# EAGLE schematic v0.7 (EAGLE 9.3.2)
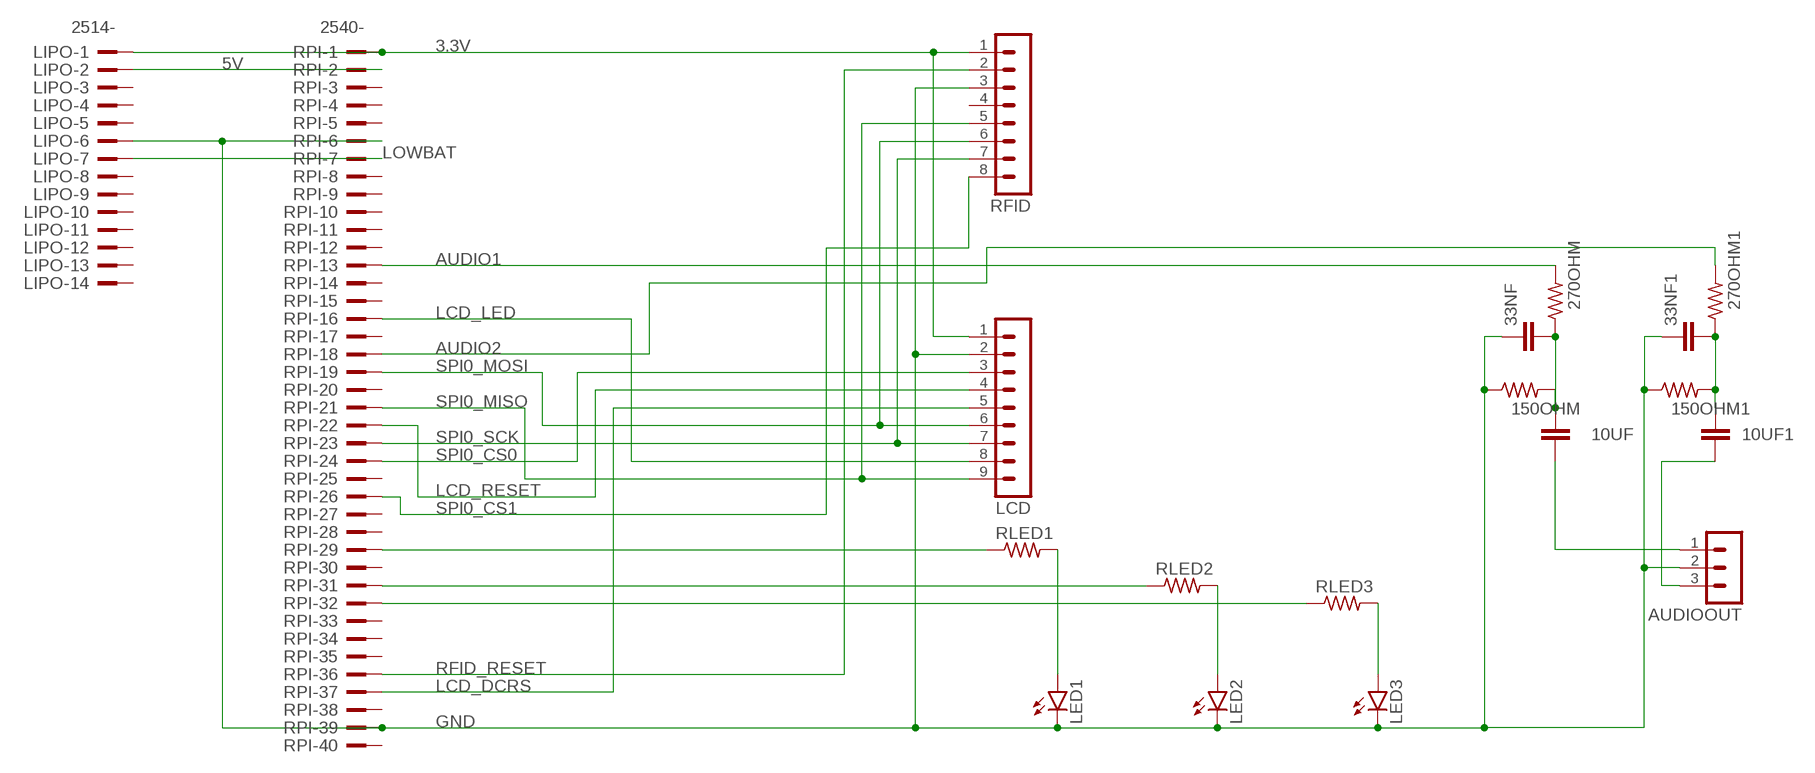
[diagram p0: schematic, sheet 1]

## Parts
10UF  C-EU025-025X050  [C025-025X050]
10UF1  C-EU025-025X050  [C025-025X050]
33NF  C-EU025-025X050  [C025-025X050]
33NF1  C-EU025-025X050  [C025-025X050]
150OHM  R-US_0204/5  [0204/5]
150OHM1  R-US_0204/5  [0204/5]
270OHM  R-US_0204/5  [0204/5]
270OHM1  R-US_0204/5  [0204/5]
AUDIOOUT  MA03-1  [MA03-1]
LCD  MA09-1  [MA09-1]
LED1  LED3MM  [LED3MM]
LED2  LED3MM  [LED3MM]
LED3  LED3MM  [LED3MM]
LIPO  2514-  [PAK100/2500-14]
RFID  MA08-1  [MA08-1]
RLED1  R-US_0204/5  [0204/5]
RLED2  R-US_0204/5  [0204/5]
RLED3  R-US_0204/5  [0204/5]
RPI  2540-  [PAK100/2500-40]

## Nets
3.3V [vcc]: LCD.1 LIPO.1 RFID.1 RPI.1
5V [vcc]: LIPO.2 RPI.2
AUDIO1 [audio]: 270OHM.2 RPI.13
AUDIO2 [audio]: 270OHM1.2 RPI.18
GND [ground]: 33NF1.1 33NF.1 150OHM1.1 150OHM.1 AUDIOOUT.2 LCD.2 LED1.K(C) LED2.K(C) LED3.K(C) LIPO.6 RFID.3 RPI.6 RPI.39
LCD_DCRS: LCD.5 RPI.37
LCD_LED: LCD.8 RPI.16
LCD_RESET: LCD.4 RPI.22
LOWBAT: LIPO.7 RPI.7
N$1: 10UF.2 33NF.2 150OHM.2 270OHM.1
N$2: LED2.A RLED2.2
N$3: LED3.A RLED3.2
N$4: RLED1.1 RPI.29
N$5: RLED2.1 RPI.31
N$6: RLED3.1 RPI.32
N$7: 10UF1.2 33NF1.2 150OHM1.2 270OHM1.1
N$8 [audio]: 10UF.1 AUDIOOUT.1
N$9 [audio]: 10UF1.1 AUDIOOUT.3
N$11: LED1.A RLED1.2
RFID_RESET: RFID.2 RPI.36
SPI0_CS0: LCD.3 RPI.24
SPI0_CS1: RFID.8 RPI.26
SPI0_MISO: LCD.9 RFID.5 RPI.21
SPI0_MOSI: LCD.6 RFID.6 RPI.19
SPI0_SCK: LCD.7 RFID.7 RPI.23
Unconnected: LIPO.3 LIPO.4 LIPO.5 LIPO.8 LIPO.9 LIPO.10 LIPO.11 LIPO.12 LIPO.13 LIPO.14 RFID.4 RPI.3 RPI.4 RPI.5 RPI.8 RPI.9 RPI.10 RPI.11 RPI.12 RPI.14 RPI.15 RPI.17 RPI.20 RPI.25 RPI.27 RPI.28 RPI.30 RPI.33 RPI.34 RPI.35 RPI.38 RPI.40

## Library data of the parts
10UF 10UF1 33NF 33NF1 = rcl:C-EU: CAPACITOR, European symbol; SPICEPREFIX: C
150OHM 150OHM1 270OHM 270OHM1 RLED1-RLED3 = rcl:R-US_: RESISTOR, American symbol; SPICEPREFIX: R
AUDIOOUT = con-lstb:MA03-1: PIN HEADER; OC_FARNELL: unknown; OC_NEWARK: unknown
LCD = con-lstb:MA09-1: PIN HEADER; OC_FARNELL: unknown; OC_NEWARK: unknown
LED1-LED3 = led:LED: LED OSRAM: - CHIPLED LG R971, LG N971, LY N971, LG Q971, LY Q971, LO R971, LY R971 LH N974, LH R974 LS Q976, LO Q976, LY Q976 LO Q996 - Hyper CHIPLED LW Q18S LB Q993, LB Q99A, LB R99A - SideLED LS A670, LO A670, LY A670, LG A670, LP A670 LB A673, LV A673, LT A673, LW A673 LH A674 LY A675 LS A676, LA A676, LO A676, LY A676, LW A676 LS A679, LY A679, LG A679 - Hyper Micro SIDELED® LS Y876, LA Y876, LO Y876, LY Y876 LT Y87S - SmartLED LW L88C, LW L88S LB L89C, LB L89S, LG L890 LS L89K, LO L89K, LY L89K LS L896, LA L896, LO L896, LY L896 - TOPLED LS T670, LO T670, LY T670, LG T670, LP T670 LSG T670, LSP T670, LSY T670, LOP T670, LYG T670 LG T671, LOG T671, LSG T671 LB T673, LV T673, LT T673, LW T673 LH T674 LS T676, LA T676, LO T676, LY T676, LB T676, LH T676, LSB T676, LW T676 LB T67C, LV T67C, LT T67C, LS T67K, LO T67K, LY T67K, LW E67C LS E67B, LA E67B, LO E67B, LY E67B, LB E67C, LV E67C, LT E67C LW T67C LS T679, LY T679, LG T679 LS T770, LO T770, LY T770, LG T770, LP T770 LB T773, LV T773, LT T773, LW T773 LH T774 LS E675, LA E675, LY E675, LS T675 LS T776, LA T776, LO T776, LY T776, LB T776 LHGB T686 LT T68C, LB T68C - Hyper Mini TOPLED® LB M676 - Mini TOPLED Santana® LG M470 LS M47K, LO M47K, LY M47K Source: http://www.osram.convergy.de LUXEON: - LUMILED® LXK2-PW12-R00, LXK2-PW12-S00, LXK2-PW14-U00, LXK2-PW14-V00 LXK2-PM12-R00, LXK2-PM12-S00, LXK2-PM14-U00 LXK2-PE12-Q00, LXK2-PE12-R00, LXK2-PE12-S00, LXK2-PE14-T00, LXK2-PE14-U00 LXK2-PB12-K00, LXK2-PB12-L00, LXK2-PB12-M00, LXK2-PB14-N00, LXK2-PB14-P00, LXK2-PB14-Q00 LXK2-PR12-L00, LXK2-PR12-M00, LXK2-PR14-Q00, LXK2-PR14-R00 LXK2-PD12-Q00, LXK2-PD12-R00, LXK2-PD12-S00 LXK2-PH12-R00, LXK2-PH12-S00 LXK2-PL12-P00, LXK2-PL12-Q00, LXK2-PL12-R00 Source: www.luxeon.com KINGBRIGHT: KA-3528ASYC Source: www.kingbright.com
LIPO = con-3m:2514-: 3M (TM) Pak 100 4-Wall Header Source: 3M; OC_FARNELL: unknown; OC_NEWARK: unknown
RFID = con-lstb:MA08-1: PIN HEADER; OC_FARNELL: unknown; OC_NEWARK: unknown
RPI = con-3m:2540-: 3M (TM) Pak 100 4-Wall Header Source: 3M; OC_FARNELL: unknown; OC_NEWARK: unknown

## Net classes
0 default: width 0.635 mm
1 ground: width 1.27 mm
2 vcc: width 1.27 mm
3 audio: width 1.27 mm